# Altium schematic sheet 3a_Motor_Interface.SchDoc
size B
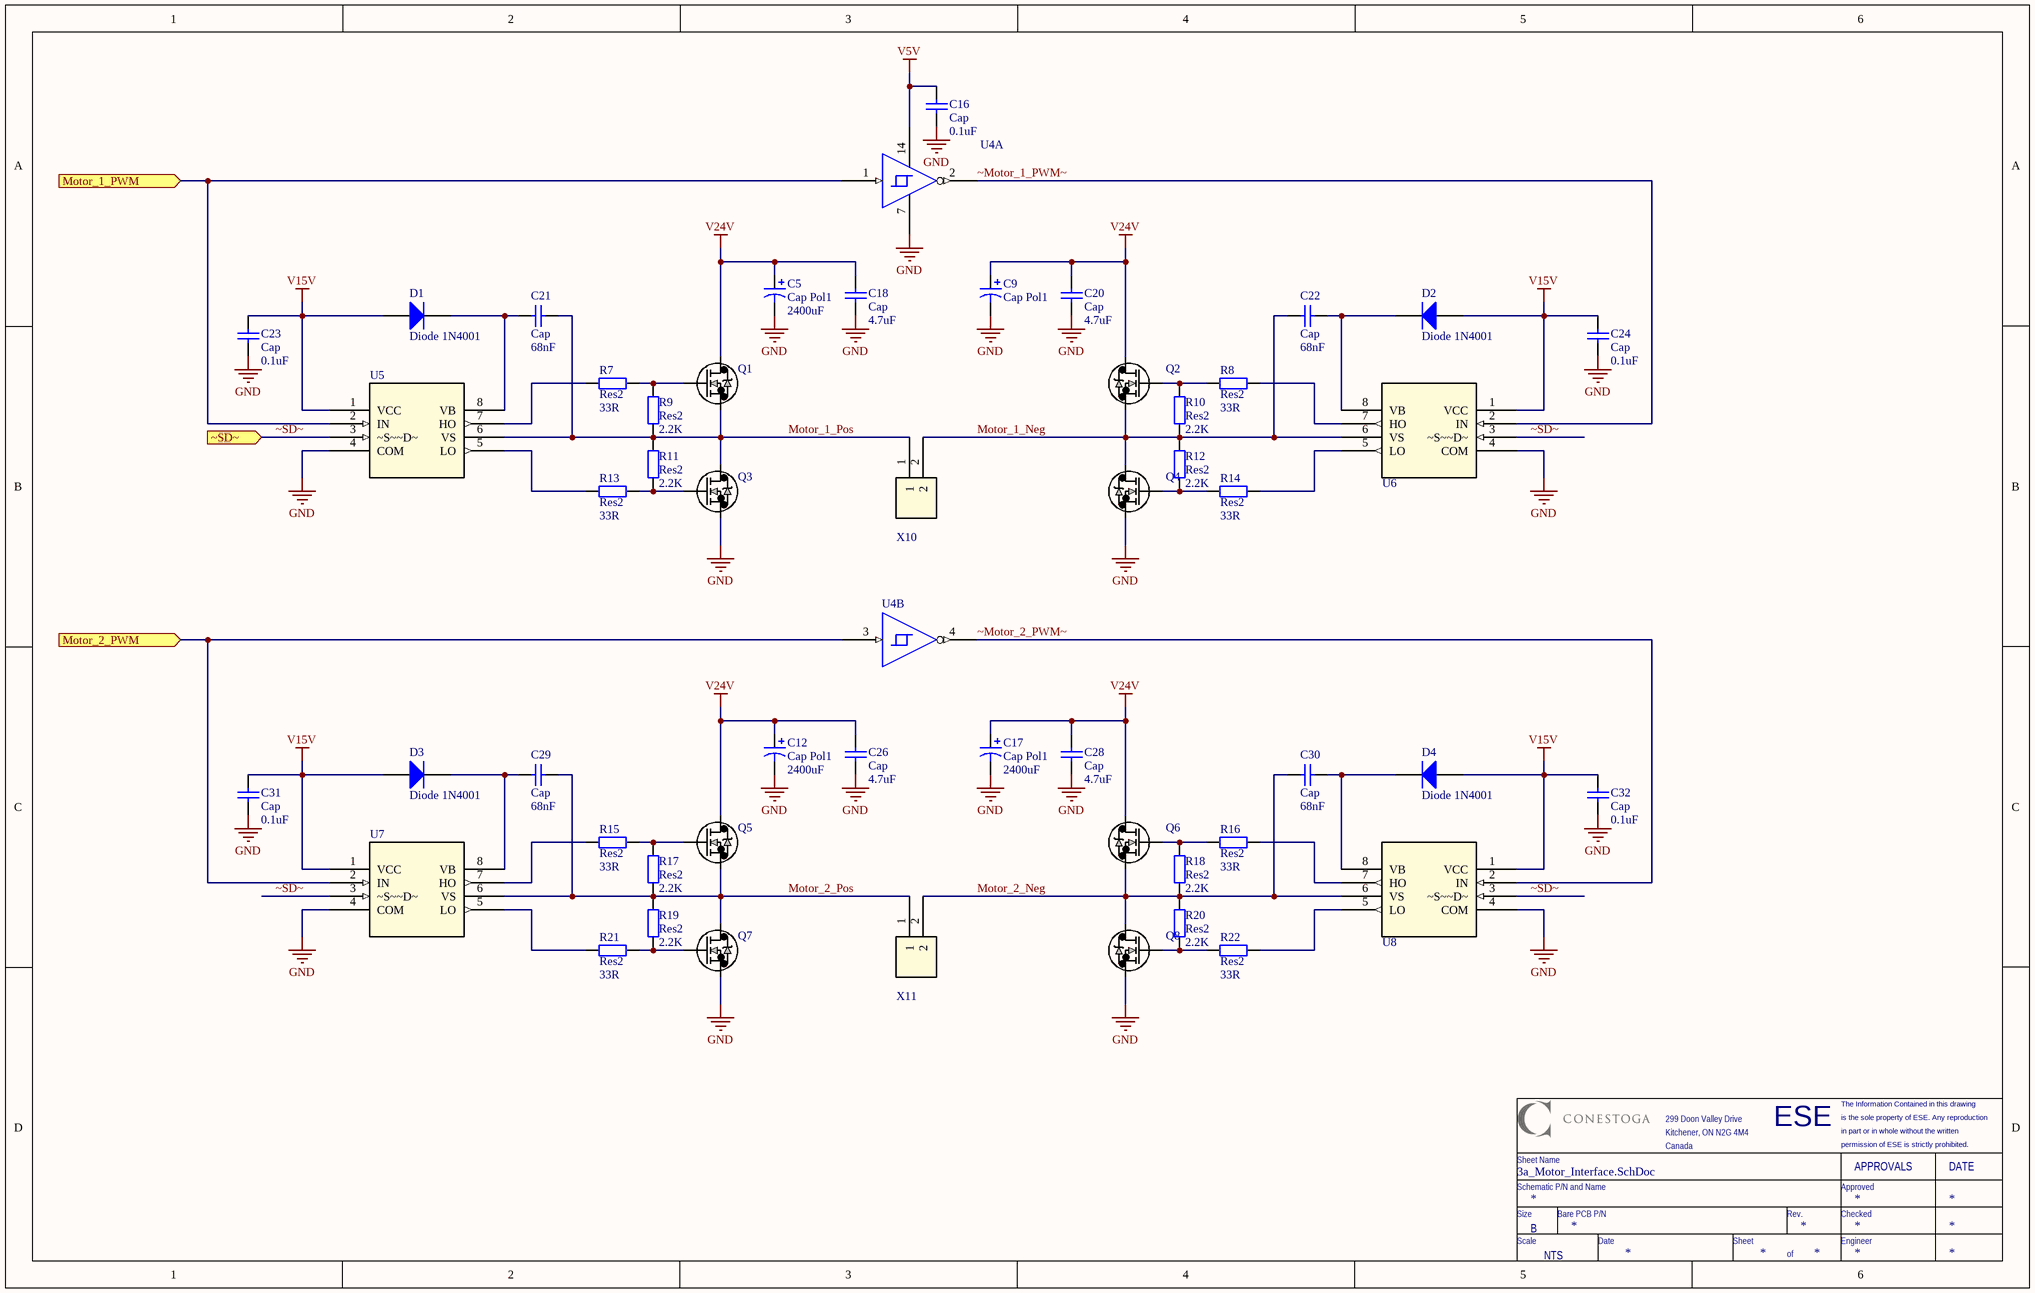
[diagram p0: 3a_Motor_Interface.SchDoc]

## Parts
C5  Cap Pol1  value 2400uF  [RB7.6-15]
C9  Cap Pol1  [RB7.6-15]
C12  Cap Pol1  value 2400uF  [RB7.6-15]
C16  Cap  value 0.1uF  [RAD-0.3]
C17  Cap Pol1  value 2400uF  [RB7.6-15]
C18  Cap  value 4.7uF  [RAD-0.3]
C20  Cap  value 4.7uF  [RAD-0.3]
C21  Cap  value 68nF  [RAD-0.3]
C22  Cap  value 68nF  [RAD-0.3]
C23  Cap  value 0.1uF  [RAD-0.3]
C24  Cap  value 0.1uF  [RAD-0.3]
C26  Cap  value 4.7uF  [RAD-0.3]
C28  Cap  value 4.7uF  [RAD-0.3]
C29  Cap  value 68nF  [RAD-0.3]
C30  Cap  value 68nF  [RAD-0.3]
C31  Cap  value 0.1uF  [RAD-0.3]
C32  Cap  value 0.1uF  [RAD-0.3]
D1  Diode 1N4001  [DO-41]
D2  Diode 1N4001  [DO-41]
D3  Diode 1N4001  [DO-41]
D4  Diode 1N4001  [DO-41]
Q1  STP100N6F7  [TO-220]  (value not drawn)
Q2  STP100N6F7  [TO-220]  (value not drawn)
Q3  STP100N6F7  [TO-220]  (value not drawn)
Q4  STP100N6F7  [TO-220]  (value not drawn)
Q5  STP100N6F7  [TO-220]  (value not drawn)
Q6  STP100N6F7  [TO-220]  (value not drawn)
Q7  STP100N6F7  [TO-220]  (value not drawn)
Q8  STP100N6F7  [TO-220]  (value not drawn)
R7  Res2  value 33R  [AXIAL-0.4]
R8  Res2  value 33R  [AXIAL-0.4]
R9  Res2  value 2.2K  [AXIAL-0.4]
R10  Res2  value 2.2K  [AXIAL-0.4]
R11  Res2  value 2.2K  [AXIAL-0.4]
R12  Res2  value 2.2K  [AXIAL-0.4]
R13  Res2  value 33R  [AXIAL-0.4]
R14  Res2  value 33R  [AXIAL-0.4]
R15  Res2  value 33R  [AXIAL-0.4]
R16  Res2  value 33R  [AXIAL-0.4]
R17  Res2  value 2.2K  [AXIAL-0.4]
R18  Res2  value 2.2K  [AXIAL-0.4]
R19  Res2  value 2.2K  [AXIAL-0.4]
R20  Res2  value 2.2K  [AXIAL-0.4]
R21  Res2  value 33R  [AXIAL-0.4]
R22  Res2  value 33R  [AXIAL-0.4]
U4  IC HEX SCHMITT-TRIG INV 14-DIP  [14-DIP]  (value not drawn)  (parts A,B of 6)
U5  IC DRIVER HALF BRIDGE 8DIP  [8-DIP]  (value not drawn)
U6  IC DRIVER HALF BRIDGE 8DIP  [8-DIP]  (value not drawn)
U7  IC DRIVER HALF BRIDGE 8DIP  [8-DIP]  (value not drawn)
U8  IC DRIVER HALF BRIDGE 8DIP  [8-DIP]  (value not drawn)
X10  TERM BLOCK HDR 2POS VERT 3.5MM  [WR-TBL-3211 2]  (value not drawn)
X11  TERM BLOCK HDR 2POS VERT 3.5MM  [WR-TBL-3211 2]  (value not drawn)

## Ports
Motor_1_PWM (in), Motor_2_PWM (in), ~SD~ (in)

## Nets
GND: C5.2 C9.2 C12.2 C16.1 C17.2 C18.1 C20.1 C23.1 C24.1 C26.1 C28.1 C31.1 C32.1 Q3.3 Q4.3 Q7.3 Q8.3 U4.7(GND_POWER) U5.4(COM) U6.4(COM) U7.4(COM) U8.4(COM)
V5V: C16.2 U4.14(VCC)
V15V: C23.2 C24.2 C31.2 C32.2 D1.1(A) D2.1(A) D3.1(A) D4.1(A) U5.1(VCC) U6.1(VCC) U7.1(VCC) U8.1(VCC)
V24V: C5.1 C9.1 C12.1 C17.1 C18.2 C20.2 C26.2 C28.2 Q1.2 Q2.2 Q5.2 Q6.2
Motor_1_Neg: C22.1 Q2.3 Q4.2 R10.2 R12.1 U6.6(VS) X10.2
Motor_1_Pos: C21.1 Q1.3 Q3.2 R9.2 R11.1 U5.6(VS) X10.1
Motor_1_PWM: U4.1(A) U5.2(IN) ; port Motor_1_PWM
Motor_2_Neg: C30.1 Q6.3 Q8.2 R18.2 R20.1 U8.6(VS) X11.2
Motor_2_Pos: C29.1 Q5.3 Q7.2 R17.2 R19.1 U7.6(VS) X11.1
Motor_2_PWM: U4.3(A) U7.2(IN) ; port Motor_2_PWM
~Motor_1_PWM~: U4.2(Y) U6.2(IN)
~Motor_2_PWM~: U4.4(Y) U8.2(IN)
~SD~: U5.3(~S~~D~) U6.3(~S~~D~) U7.3(~S~~D~) U8.3(~S~~D~) ; port ~SD~
NetC21_2: C21.2 D1.2(K) U5.8(VB)
NetC22_2: C22.2 D2.2(K) U6.8(VB)
NetC29_2: C29.2 D3.2(K) U7.8(VB)
NetC30_2: C30.2 D4.2(K) U8.8(VB)
NetQ1_1: Q1.1 R7.1 R9.1
NetQ2_1: Q2.1 R8.1 R10.1
NetQ3_1: Q3.1 R11.2 R13.1
NetQ4_1: Q4.1 R12.2 R14.1
NetQ5_1: Q5.1 R15.1 R17.1
NetQ6_1: Q6.1 R16.1 R18.1
NetQ7_1: Q7.1 R19.2 R21.1
NetQ8_1: Q8.1 R20.2 R22.1
NetR7_2: R7.2 U5.7(HO)
NetR8_2: R8.2 U6.7(HO)
NetR13_2: R13.2 U5.5(LO)
NetR14_2: R14.2 U6.5(LO)
NetR15_2: R15.2 U7.7(HO)
NetR16_2: R16.2 U8.7(HO)
NetR21_2: R21.2 U7.5(LO)
NetR22_2: R22.2 U8.5(LO)

## Notes on the sheet
- ESE
- is the sole property of ESE. Any reproduction
- The Information Contained in this drawing
- Schematic P/N and Name
- Sheet Name
- 299 Doon Valley Drive
- Kitchener, ON N2G 4M4
- Canada
- Approved
- in part or in whole without the written
- permission of ESE is strictly prohibited.
- APPROVALS
- DATE
- Size
- Scale
- B
- NTS
- Bare PCB P/N
- Date
- Sheet
- Rev.
- Checked
- Engineer
- of

## Library data of the parts
C5 C9 C12 C17 = Cap Pol1: Polarized Capacitor (Radial); Published: 8-Jun-2000; LatestRevisionDate: 17-Jul-2002; LatestRevisionNote: Re-released for DXP Platform.; PackageReference: RB7.6-15; Publisher: Altium Limited; PackageDescription: Polarized Capacitor (Radial); 2 Leads
C16 C18 C20-C24 C26 C28-C32 = Cap: Capacitor; Published: 8-Jun-2000; LatestRevisionDate: 17-Jul-2002; LatestRevisionNote: Re-released for DXP Platform.; PackageReference: RAD-0.3; Publisher: Altium Limited; PackageDescription: Radial Cap, Thru-Hole; 2 Leads; 0.3 in Pin Spacing
D1-D4 = Diode 1N4001: 1 Amp General Purpose Rectifier; Published: 8-Jun-2000; LatestRevisionDate: 17-Jul-2002; LatestRevisionNote: Re-released for DXP Platform.; DatasheetVersion: 1998; PackageVersion: Aug-1999; PackageReference: DO-41; Publisher: Altium Limited; PackageDescription: Diode, Axial; Body 5.2 x 2.7 mm (LxDia. max), Lead Dia. 0.86 mm (max); Code_JEDEC: DO-204-AL; ComponentLink1Description: Manufacturer Link; ComponentLink1URL: http://www.fairchildsemi.com/; ComponentLink2Description: Datasheet; ComponentLink2URL: http://www.fairchildsemi.com/ds/1N%2F1N4001.pdf
Q1-Q8 = STP100N6F7: Vendor: STMicroelectronics; Manufacturer_Part_Number: STP100N6F7; Digi-Key_Part_Number: 497-15888-5-ND
R7-R22 = Res2: Resistor; Published: 8-Jun-2000; LatestRevisionDate: 17-Jul-2002; LatestRevisionNote: Re-released for DXP Platform.; PackageReference: AXIAL-0.4; Publisher: Altium Limited; PackageDescription: Axial Device, Thru-Hole; 2 Leads; 0.4 in Pin Spacing
U4 = IC HEX SCHMITT-TRIG INV 14-DIP: Manufactuer_Part_Number: SN74ACT14N; Manufacturer: Texas Instruments; Digi-Key_Part_Number: 296-4368-5-ND
U5-U8 = IC DRIVER HALF BRIDGE 8DIP: Manufacturer_Part_Number: IR2109PBF; Manufacturer: Infineon Technologies; Digi-Key_Part_Number: IR2109PBF-ND
X10 X11 = TERM BLOCK HDR 2POS VERT 3.5MM: Manufacturer_Part_Number: 691321100002; Manufacturer: Wurth Electronics Inc; DigiKey_Part_Number: 732-2763-ND